# EAGLE schematic main (EAGLE 4.09)

## Sheet 1 of 8
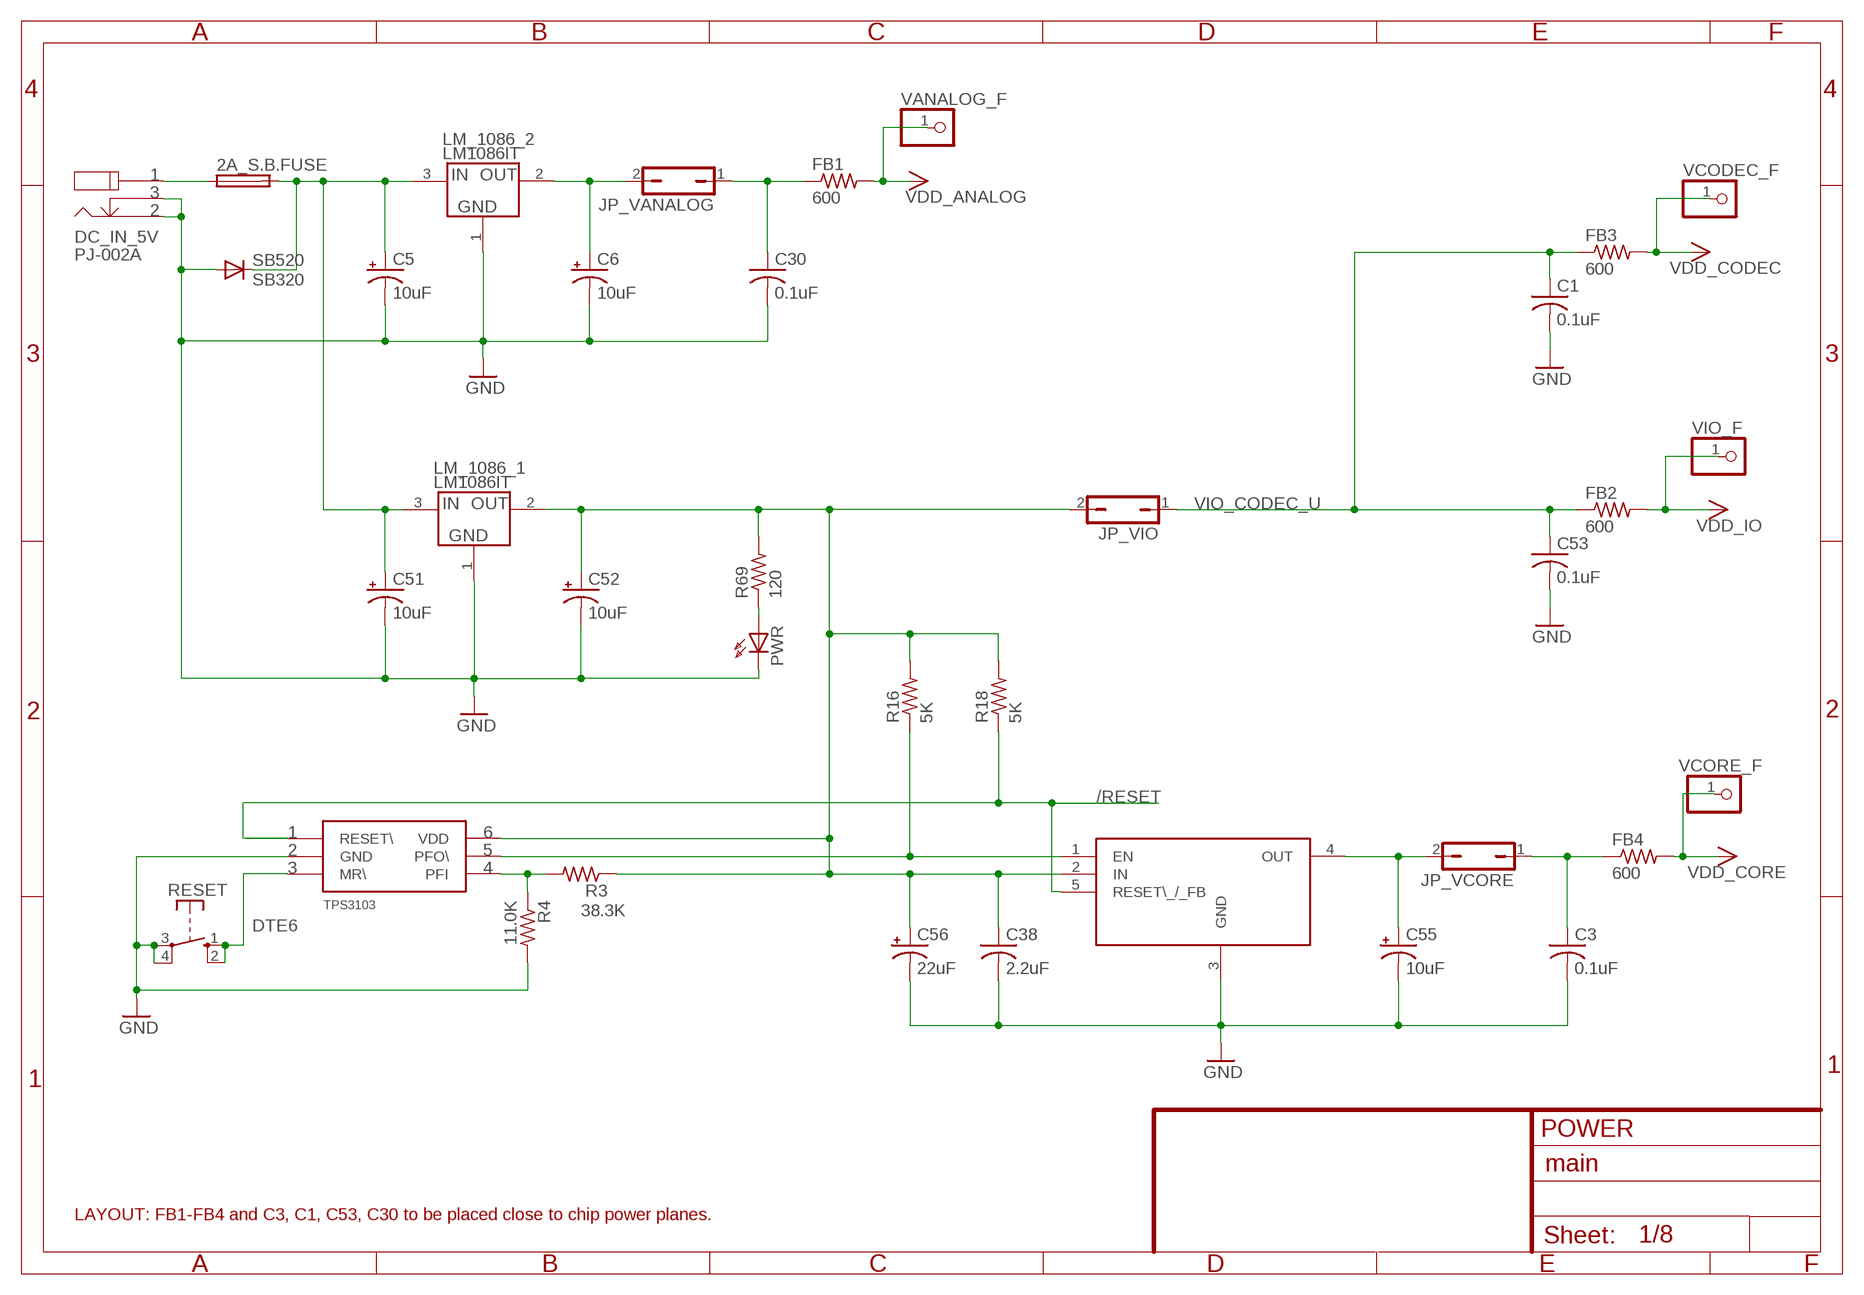
[diagram p0: schematic, sheet 1]

### Parts
2A_S.B.FUSE  LITTLEFUSE  [LITTLEFUSE]
C1  0.1uF  C-USC0603K  [C0603K]
C3  0.1uF  C-USC0603K  [C0603K]
C5  10uF  CPOL-USA/3216-18W  [A/3216-18W]
C6  10uF  CPOL-USA/3216-18W  [A/3216-18W]
C30  0.1uF  C-USC0603K  [C0603K]
C38  2.2uF  C-USC0603K  [C0603K]
C51  10uF  CPOL-USA/3216-18W  [A/3216-18W]
C52  10uF  CPOL-USA/3216-18W  [A/3216-18W]
C53  0.1uF  C-USC0603K  [C0603K]
C55  10uF  CPOL-USA/3216-18W  [A/3216-18W]
C56  22uF  CPOL-USA/3216-18W  [A/3216-18W]
DC_IN_5V  PJ-002A  [PJ-002A]
FB1  600  R-US_R1206  [R1206]
FB2  600  R-US_R1206  [R1206]
FB3  600  R-US_R1206  [R1206]
FB4  600  R-US_R1206  [R1206]
JP_VANALOG  JP1Q  [JP1]
JP_VCORE  JP1Q  [JP1]
JP_VIO  JP1Q  [JP1]
LM_1086_1  LM1086IT  [TO220_HSINK]
LM_1086_2  LM1086IT  [TO220_HSINK]
PWR  LEDSMT1206  [1206]
R3  38.3K  R-US_R0603  [R0603]
R4  11.0K  R-US_R0603  [R0603]
R16  5K  R-US_R0603  [R0603]
R18  5K  R-US_R0603  [R0603]
R69  120  R-US_R0603  [R0603]
RESET  DTE6  [DTE6]
SB520  SB320  [DO201-15]
TPS3103  TPS3103  [SO-06]
VANALOG_F  PINHD-1X1  [1X01]
VCODEC_F  PINHD-1X1  [1X01]
VCORE_F  PINHD-1X1  [1X01]
VIO_F  PINHD-1X1  [1X01]
VR_CORE  TPS72518DCQR  [SOT223-5]

### Nets
/RESET: R18.1 TPS3103.P$1(RESET\) VR_CORE.5(RESET\_/_FB) ; also sheet 5,6
GND: C1.2 C3.2 C5.- C6.- C30.2 C38.2 C51.- C52.- C53.2 C55.- C56.- DC_IN_5V.2 DC_IN_5V.3 LM_1086_1.1(ADJ) LM_1086_2.1(ADJ) PWR.C R4.2 RESET.3(P) RESET.4(P) SB520.A TPS3103.P$2(GND) VR_CORE.3(GND) ; also sheet 2,3,4,5,6,7,8
N$4: 2A_S.B.FUSE.1 DC_IN_5V.1
N$25: R3.2 R4.1 TPS3103.P$4(PFI)
N$29: RESET.1(S) RESET.2(S) TPS3103.P$3(MR\)
N$30: R16.1 TPS3103.P$5(PFO\) VR_CORE.1(EN)
N$31: C6.+ JP_VANALOG.2 LM_1086_2.2(OUT)
N$72: 2A_S.B.FUSE.2 C5.+ C51.+ LM_1086_1.3(IN) LM_1086_2.3(IN) SB520.C
N$94: C55.+ JP_VCORE.2 VR_CORE.4(OUT)
N$95: PWR.A R69.1
N$97: C38.1 C52.+ C56.+ JP_VIO.2 LM_1086_1.2(OUT) R3.1 R16.2 R18.2 R69.2 TPS3103.P$6(VDD) VR_CORE.2(IN)
VANALOG_U: C30.1 FB1.1 JP_VANALOG.1
VCORE_U: C3.1 FB4.1 JP_VCORE.1
VDD_ANALOG: FB1.2 VANALOG_F.1 ; also sheet 6,7,8
VDD_CODEC: FB3.2 VCODEC_F.1 ; also sheet 6
VDD_CORE: FB4.2 VCORE_F.1 ; also sheet 2,4,5
VDD_IO: FB2.2 VIO_F.1 ; also sheet 4,5
VIO_CODEC_U: C1.1 C53.1 FB2.1 FB3.1 JP_VIO.1 ; also sheet 2,3,4,5,6

### Notes on the sheet
- POWER
- LAYOUT: FB1-FB4 and C3, C1, C53, C30 to be placed close to chip power planes.

## Sheet 2 of 8
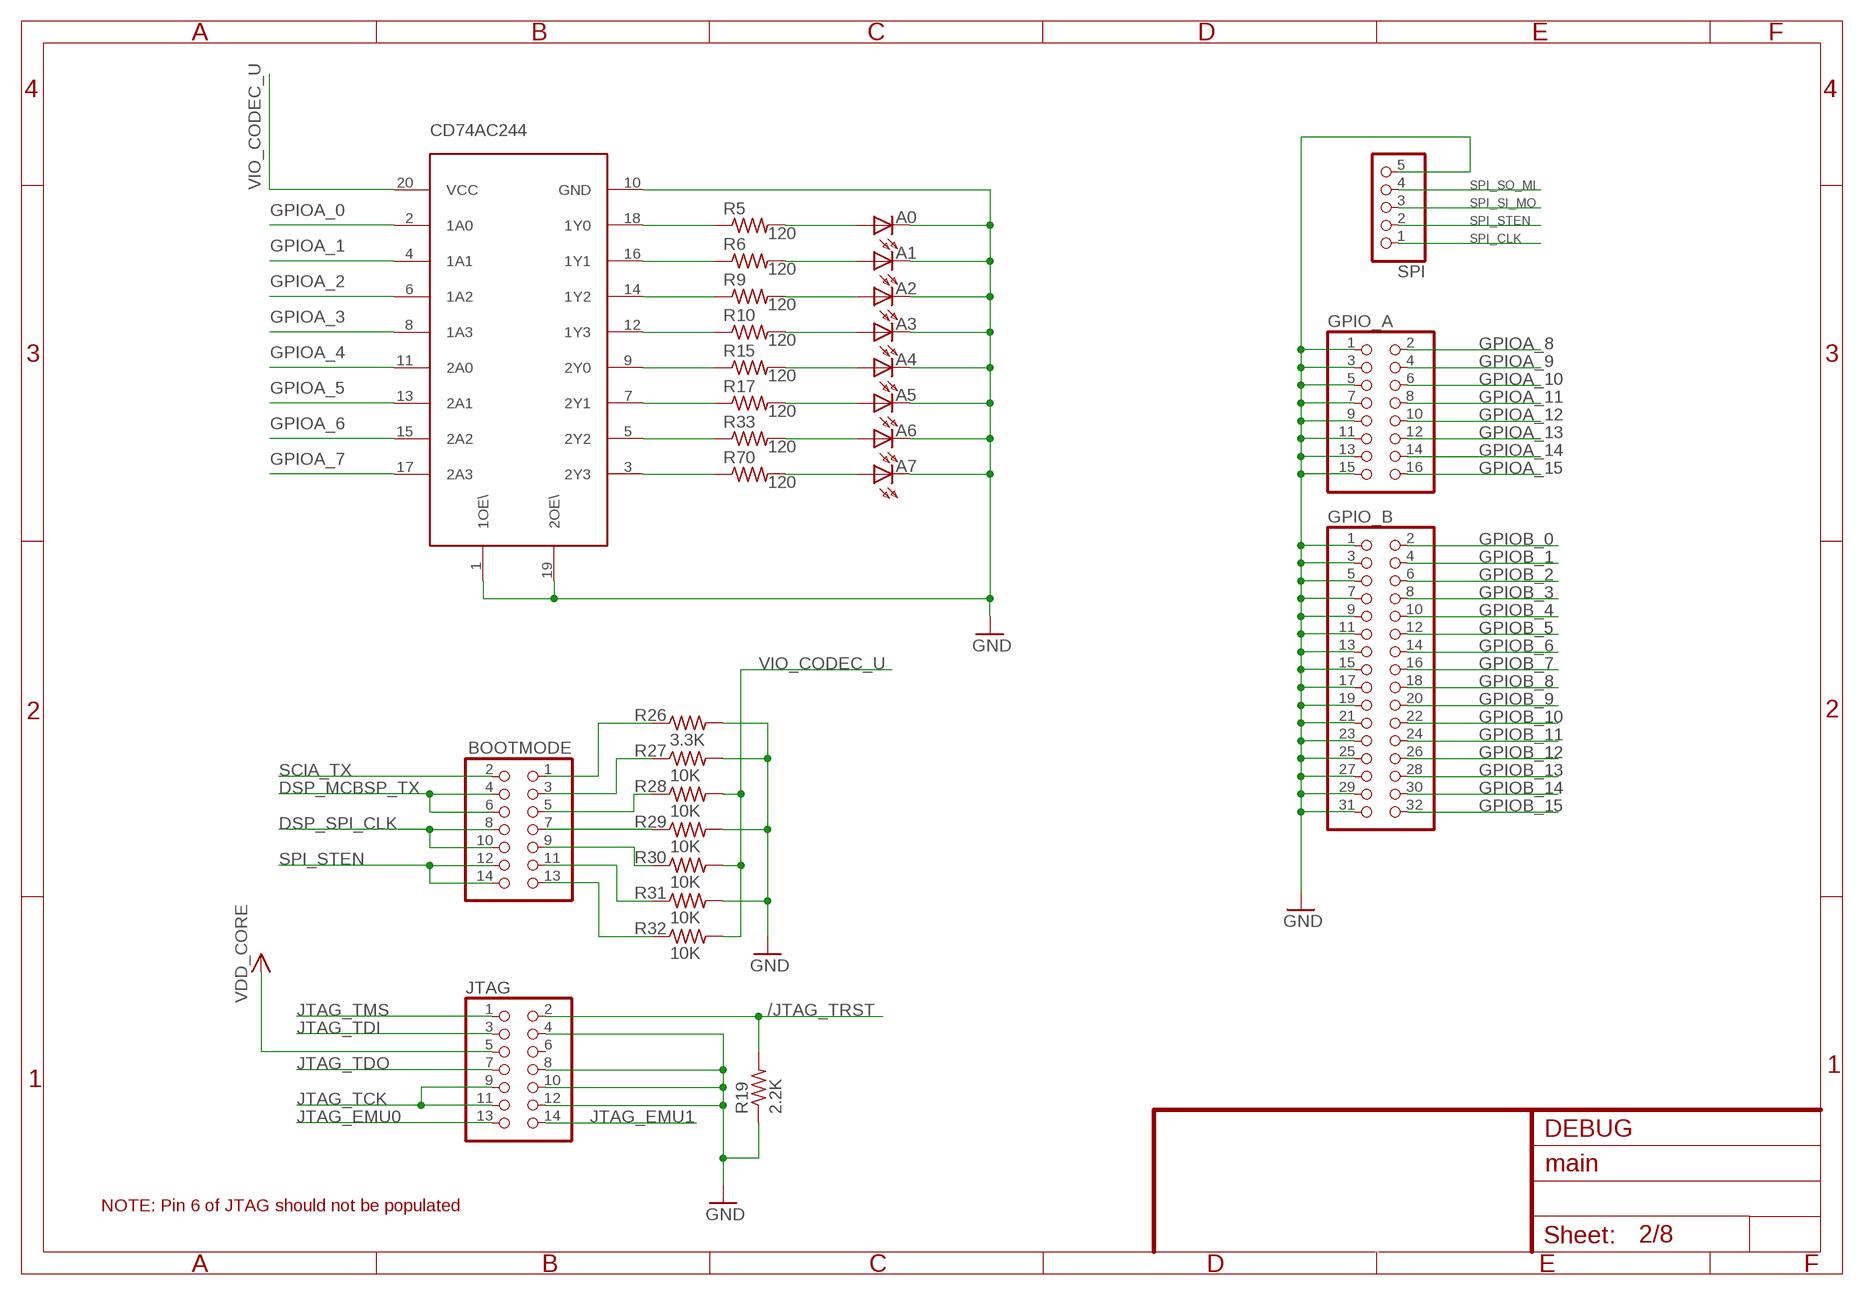
[diagram p1: schematic, sheet 2]

### Parts
A0  LEDSMT1206  [1206]
A1  LEDSMT1206  [1206]
A2  LEDSMT1206  [1206]
A3  LEDSMT1206  [1206]
A4  LEDSMT1206  [1206]
A5  LEDSMT1206  [1206]
A6  LEDSMT1206  [1206]
A7  LEDSMT1206  [1206]
BOOTMODE  PINHD-2X7  [2X07]
CD74AC244  CD74AC244  [SO-20DW]
GPIO_A  PINHD-2X8  [2X08]
GPIO_B  PINHD-2X16  [2X16]
JTAG  PINHD-2X7  [2X07]
R5  120  R-US_R0603  [R0603]
R6  120  R-US_R0603  [R0603]
R9  120  R-US_R0603  [R0603]
R10  120  R-US_R0603  [R0603]
R15  120  R-US_R0603  [R0603]
R17  120  R-US_R0603  [R0603]
R19  2.2K  R-US_R0603  [R0603]
R26  3.3K  R-US_R0603  [R0603]
R27  10K  R-US_R0603  [R0603]
R28  10K  R-US_R0603  [R0603]
R29  10K  R-US_R0603  [R0603]
R30  10K  R-US_R0603  [R0603]
R31  10K  R-US_R0603  [R0603]
R32  10K  R-US_R0603  [R0603]
R33  120  R-US_R0603  [R0603]
R70  120  R-US_R0603  [R0603]
SPI  PINHD-1X5  [1X05]

### Nets
/JTAG_TRST: JTAG.2 R19.2 ; also sheet 5
DSP_MCBSP_TX: BOOTMODE.4 BOOTMODE.6 ; also sheet 4
DSP_SPI_CLK: BOOTMODE.8 BOOTMODE.10 ; also sheet 4
GND: A0.C A1.C A2.C A3.C A4.C A5.C A6.C A7.C CD74AC244.1(1OE\) CD74AC244.10(GND) CD74AC244.19(2OE\) GPIO_A.1 GPIO_A.3 GPIO_A.5 GPIO_A.7 GPIO_A.9 GPIO_A.11 GPIO_A.13 GPIO_A.15 GPIO_B.1 GPIO_B.3 GPIO_B.5 GPIO_B.7 GPIO_B.9 GPIO_B.11 GPIO_B.13 GPIO_B.15 GPIO_B.17 GPIO_B.19 GPIO_B.21 GPIO_B.23 GPIO_B.25 GPIO_B.27 GPIO_B.29 GPIO_B.31 JTAG.4 JTAG.8 JTAG.10 JTAG.12 R19.1 R26.2 R27.2 R29.2 R31.2 SPI.5 ; also sheet 1,3,4,5,6,7,8
GPIOA_0: CD74AC244.2(1A0) ; also sheet 5
GPIOA_1: CD74AC244.4(1A1) ; also sheet 5
GPIOA_2: CD74AC244.6(1A2) ; also sheet 5
GPIOA_3: CD74AC244.8(1A3) ; also sheet 5
GPIOA_4: CD74AC244.11(2A0) ; also sheet 5
GPIOA_5: CD74AC244.13(2A1) ; also sheet 5
GPIOA_6: CD74AC244.15(2A2) ; also sheet 5
GPIOA_7: CD74AC244.17(2A3) ; also sheet 5
GPIOA_8: GPIO_A.2 ; also sheet 5
GPIOA_9: GPIO_A.4 ; also sheet 5
GPIOA_10: GPIO_A.6 ; also sheet 5
GPIOA_11: GPIO_A.8 ; also sheet 5
GPIOA_12: GPIO_A.10 ; also sheet 5
GPIOA_13: GPIO_A.12 ; also sheet 5
GPIOA_14: GPIO_A.14 ; also sheet 5
GPIOA_15: GPIO_A.16 ; also sheet 5
GPIOB_0: GPIO_B.2 ; also sheet 4
GPIOB_1: GPIO_B.4 ; also sheet 4
GPIOB_2: GPIO_B.6 ; also sheet 4
GPIOB_3: GPIO_B.8 ; also sheet 4
GPIOB_4: GPIO_B.10 ; also sheet 4
GPIOB_5: GPIO_B.12 ; also sheet 4
GPIOB_6: GPIO_B.14 ; also sheet 4
GPIOB_7: GPIO_B.16 ; also sheet 4
GPIOB_8: GPIO_B.18 ; also sheet 4
GPIOB_9: GPIO_B.20 ; also sheet 4
GPIOB_10: GPIO_B.22 ; also sheet 4
GPIOB_11: GPIO_B.24 ; also sheet 4
GPIOB_12: GPIO_B.26 ; also sheet 4
GPIOB_13: GPIO_B.28 ; also sheet 4
GPIOB_14: GPIO_B.30 ; also sheet 4
GPIOB_15: GPIO_B.32 ; also sheet 4
JTAG_EMU0: JTAG.13 ; also sheet 5
JTAG_EMU1: JTAG.14 ; also sheet 5
JTAG_TCK: JTAG.9 JTAG.11 ; also sheet 5
JTAG_TDI: JTAG.3 ; also sheet 5
JTAG_TDO: JTAG.7 ; also sheet 5
JTAG_TMS: JTAG.1 ; also sheet 5
N$1: CD74AC244.18(1Y0) R5.1
N$2: BOOTMODE.1 R26.1
N$6: BOOTMODE.3 R27.1
N$7: BOOTMODE.5 R28.1
N$9: BOOTMODE.7 R29.1
N$13: CD74AC244.16(1Y1) R6.1
N$16: BOOTMODE.9 R30.1
N$17: BOOTMODE.11 R31.1
N$21: BOOTMODE.13 R32.1
N$37: CD74AC244.14(1Y2) R9.1
N$46: CD74AC244.12(1Y3) R10.1
N$49: CD74AC244.9(2Y0) R15.1
N$57: CD74AC244.7(2Y1) R17.1
N$63: CD74AC244.5(2Y2) R33.1
N$69: CD74AC244.3(2Y3) R70.1
N$74: A0.A R5.2
N$87: A1.A R6.2
N$88: A2.A R9.2
N$89: A3.A R10.2
N$90: A4.A R15.2
N$91: A5.A R17.2
N$92: A6.A R33.2
N$93: A7.A R70.2
SCIA_TX: BOOTMODE.2 ; also sheet 3,5
SPI_CLK: SPI.1 ; also sheet 4
SPI_SI_MO: SPI.3 ; also sheet 4
SPI_SO_MI: SPI.4 ; also sheet 4
SPI_STEN: BOOTMODE.12 BOOTMODE.14 SPI.2 ; also sheet 4
VDD_CORE: JTAG.5 ; also sheet 1,4,5
VIO_CODEC_U: CD74AC244.20(VCC) R28.2 R30.2 R32.2 ; also sheet 1,3,4,5,6
Unconnected: JTAG.6

### Notes on the sheet
- DEBUG
- NOTE: Pin 6 of JTAG should not be populated

## Sheet 3 of 8
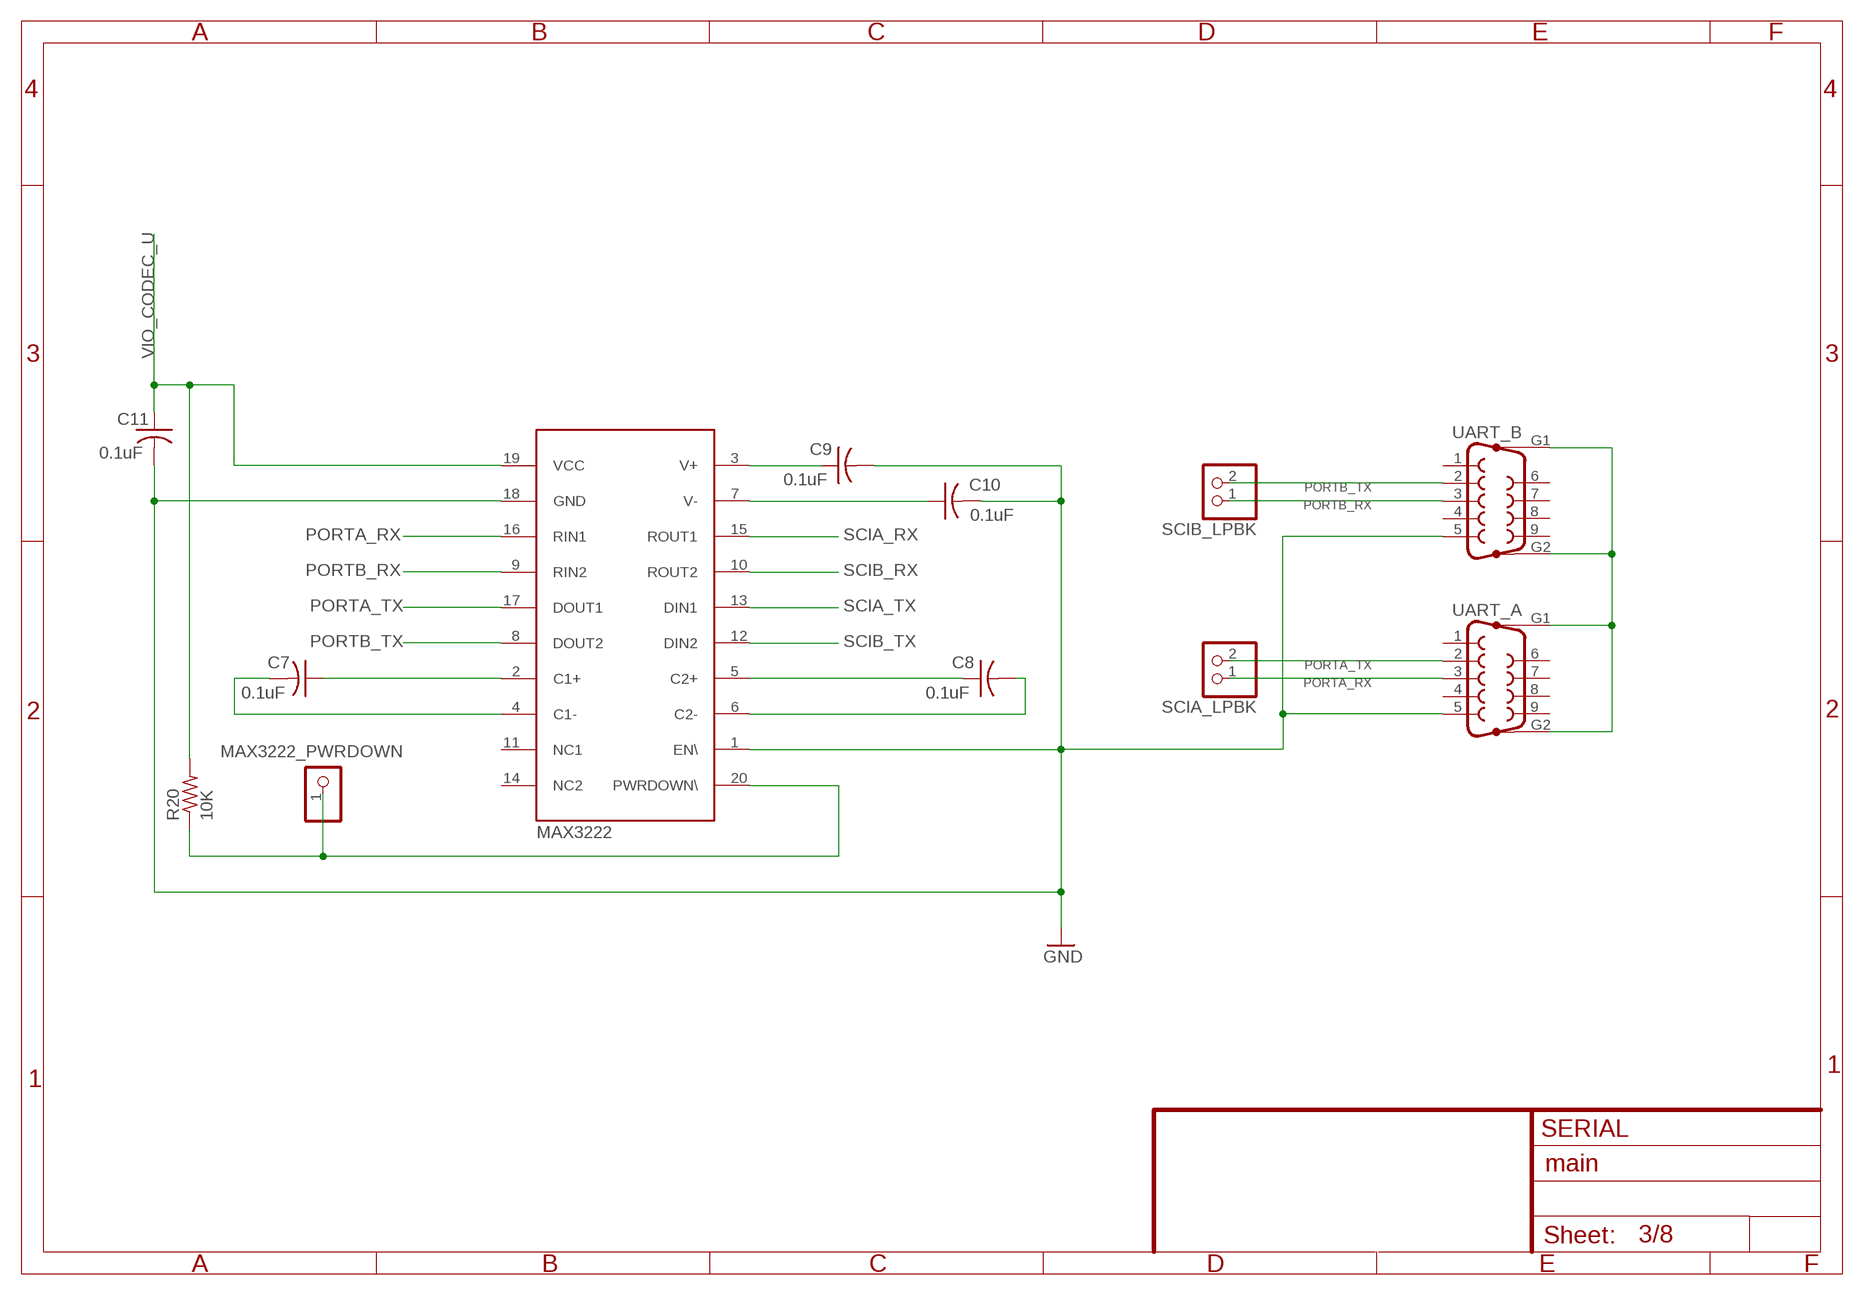
[diagram p2: schematic, sheet 3]

### Parts
C7  0.1uF  C-USC0603K  [C0603K]
C8  0.1uF  C-USC0603K  [C0603K]
C9  0.1uF  C-USC0603K  [C0603K]
C10  0.1uF  C-USC0603K  [C0603K]
C11  0.1uF  C-USC0603K  [C0603K]
MAX3222  MAX3222  [SO-20DW]
MAX3222_PWRDOWN  PINHD-1X1  [1X01]
R20  10K  R-US_R0603  [R0603]
SCIA_LPBK  PINHD-1X2  [1X02]
SCIB_LPBK  PINHD-1X2  [1X02]
UART_A  F09HP  [F09HP]
UART_B  F09HP  [F09HP]

### Nets
GND: C9.2 C10.2 C11.2 MAX3222.1(EN\) MAX3222.18(GND) UART_A.5 UART_B.5 ; also sheet 1,2,4,5,6,7,8
N$14: C7.1 MAX3222.2(C1+)
N$15: C7.2 MAX3222.4(C1-)
N$18: C8.2 MAX3222.6(C2-)
N$19: C8.1 MAX3222.5(C2+)
N$22: MAX3222.20(PWRDOWN\) MAX3222_PWRDOWN.1 R20.1
N$24: C10.1 MAX3222.7(V-)
N$26: C9.1 MAX3222.3(V+)
N$27: UART_A.G1 UART_A.G2 UART_B.G1 UART_B.G2
PORTA_RX: MAX3222.16(RIN1) SCIA_LPBK.1 UART_A.3
PORTA_TX: MAX3222.17(DOUT1) SCIA_LPBK.2 UART_A.2
PORTB_RX: MAX3222.9(RIN2) SCIB_LPBK.1 UART_B.3
PORTB_TX: MAX3222.8(DOUT2) SCIB_LPBK.2 UART_B.2
SCIA_RX: MAX3222.15(ROUT1) ; also sheet 5
SCIA_TX: MAX3222.13(DIN1) ; also sheet 2,5
SCIB_RX: MAX3222.10(ROUT2) ; also sheet 5
SCIB_TX: MAX3222.12(DIN2) ; also sheet 5
VIO_CODEC_U: C11.1 MAX3222.19(VCC) R20.2 ; also sheet 1,2,4,5,6
Unconnected: MAX3222.11(NC1) MAX3222.14(NC2) UART_A.1 UART_A.4 UART_A.6 UART_A.7 UART_A.8 UART_A.9 UART_B.1 UART_B.4 UART_B.6 UART_B.7 UART_B.8 UART_B.9

### Notes on the sheet
- SERIAL

## Sheet 4 of 8
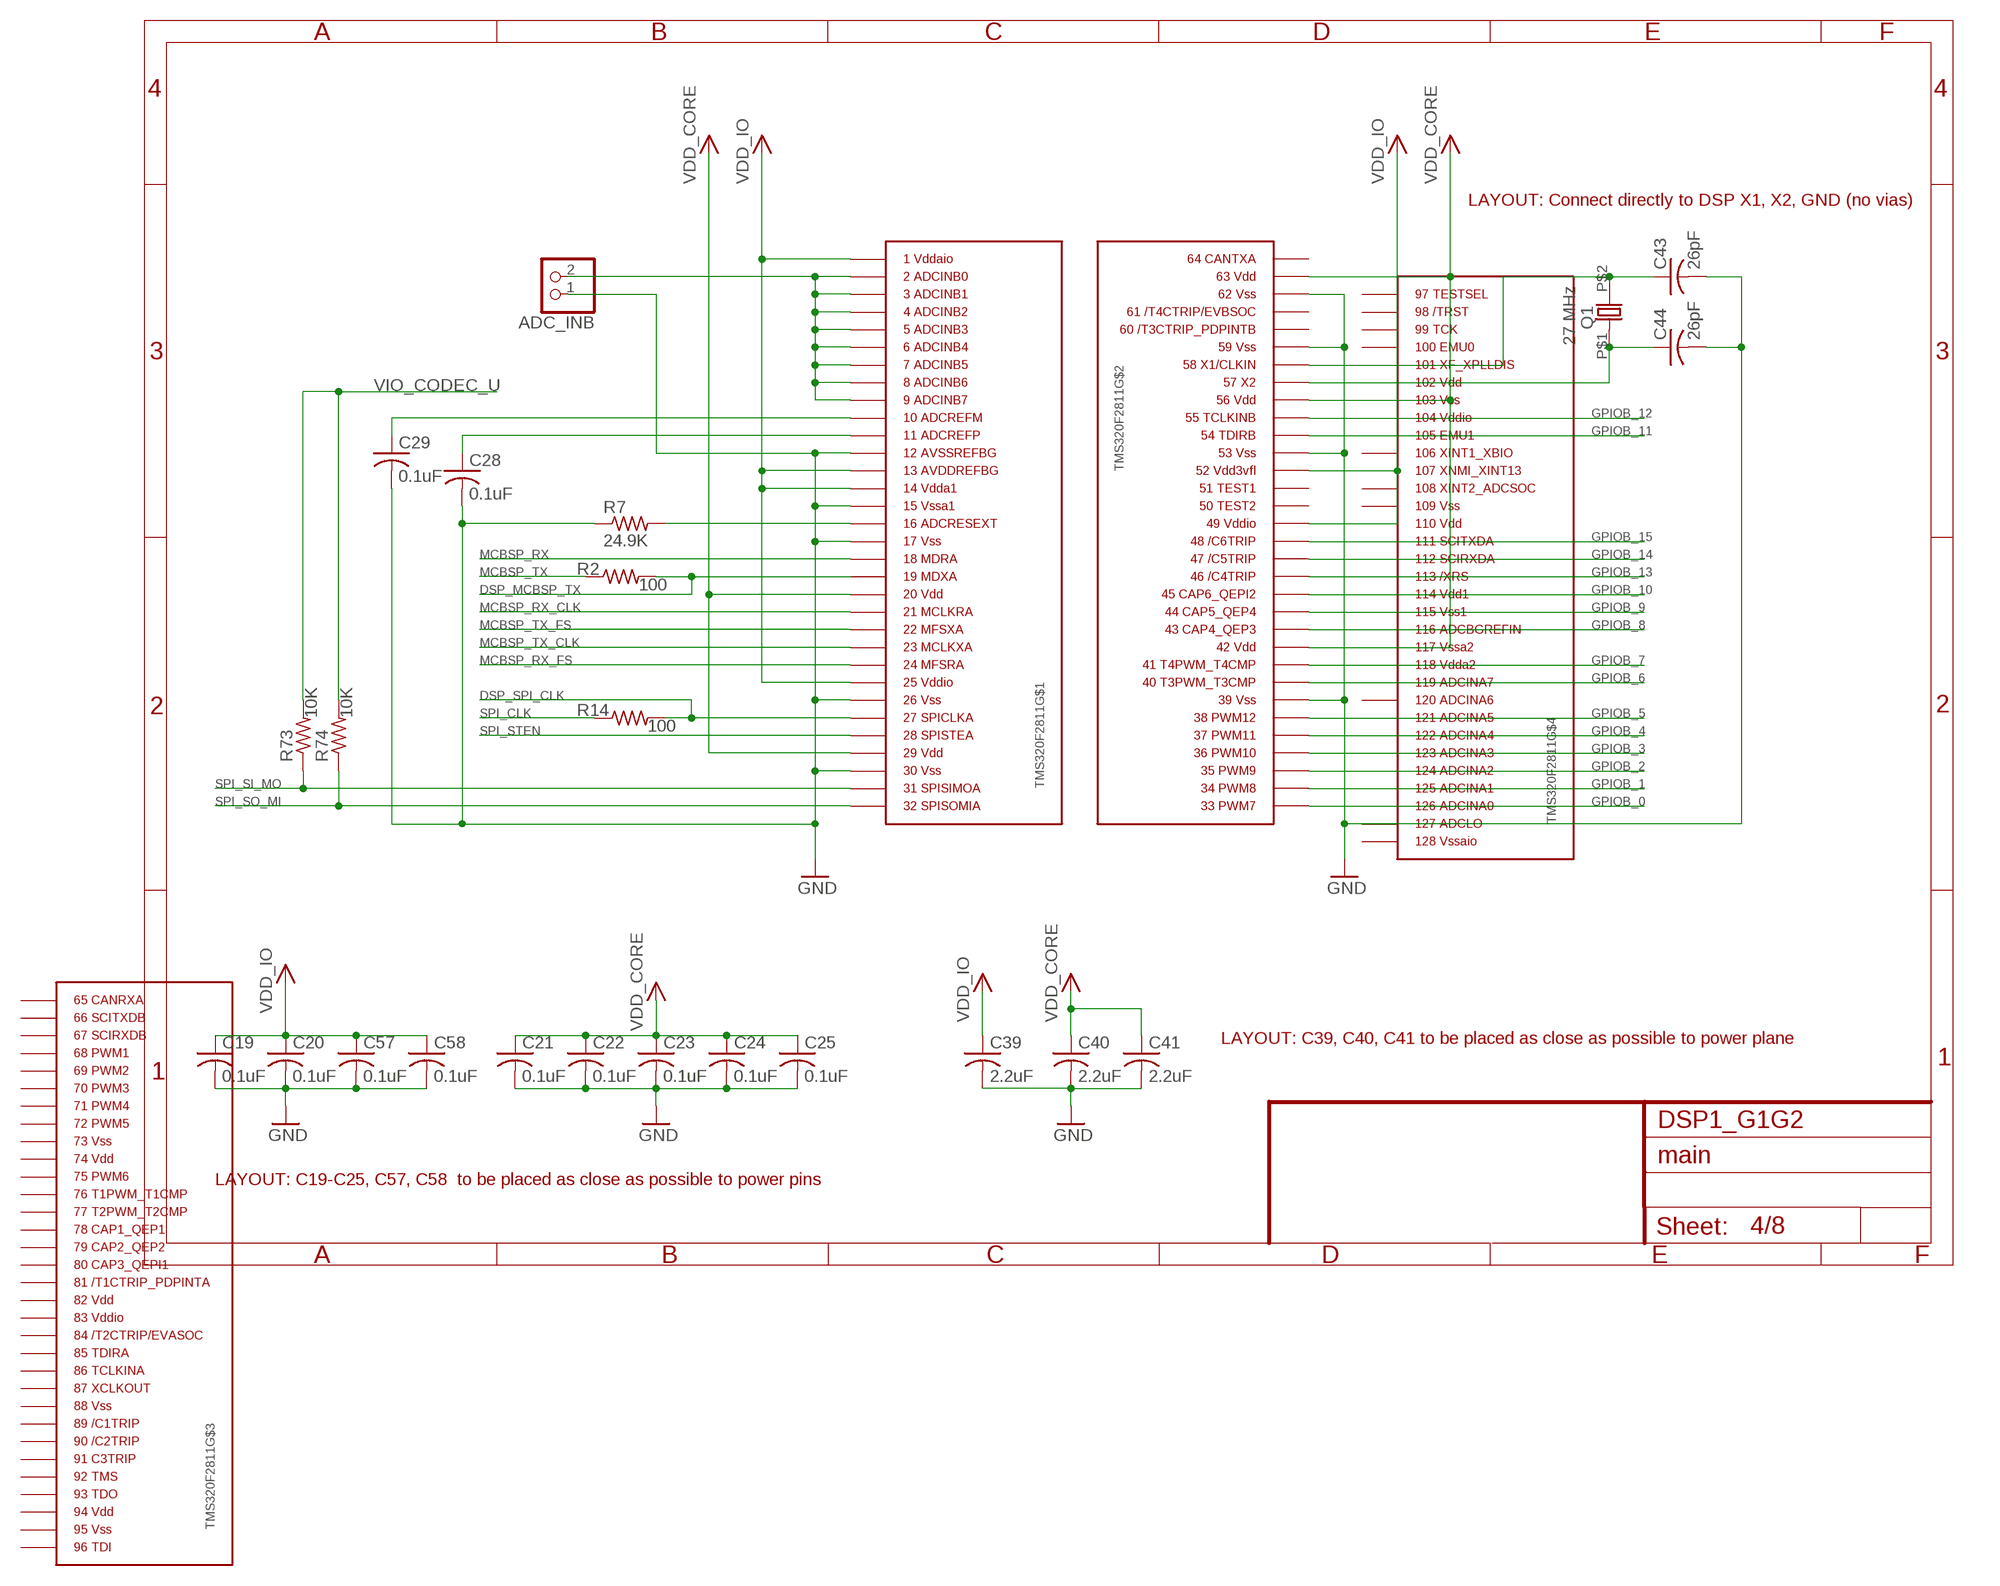
[diagram p3: schematic, sheet 4]

### Parts
ADC_INB  PINHD-1X2  [1X02]
C19  0.1uF  C-USC0603K  [C0603K]
C20  0.1uF  C-USC0603K  [C0603K]
C21  0.1uF  C-USC0603K  [C0603K]
C22  0.1uF  C-USC0603K  [C0603K]
C23  0.1uF  C-USC0603K  [C0603K]
C24  0.1uF  C-USC0603K  [C0603K]
C25  0.1uF  C-USC0603K  [C0603K]
C28  0.1uF  C-USC0603K  [C0603K]
C29  0.1uF  C-USC0603K  [C0603K]
C39  2.2uF  C-USC0805K  [C0805K]
C40  2.2uF  C-USC0805K  [C0805K]
C41  2.2uF  C-USC0805K  [C0805K]
C43  26pF  C-USC0603K  [C0603K]
C44  26pF  C-USC0603K  [C0603K]
C57  0.1uF  C-USC0603K  [C0603K]
C58  0.1uF  C-USC0603K  [C0603K]
Q1  27 MHz  CSA-309  [CSA-309]
R2  100  R-US_R0603  [R0603]
R7  24.9K  R-US_R0603  [R0603]
R14  100  R-US_R0603  [R0603]
R73  10K  R-US_R0603  [R0603]
R74  10K  R-US_R0603  [R0603]
TMS320F2811  TMS3202810  [PQFPG128]

### Nets
DSP_MCBSP_TX: R2.2 TMS320F2811.P$19 ; also sheet 2
DSP_SPI_CLK: R14.2 TMS320F2811.P$27 ; also sheet 2
GND: ADC_INB.1 C19.2 C20.2 C21.2 C22.2 C23.2 C24.2 C25.2 C28.2 C29.2 C39.2 C40.2 C41.2 C43.2 C44.2 C57.2 C58.2 R7.1 TMS320F2811.P$12 TMS320F2811.P$15 TMS320F2811.P$17 TMS320F2811.P$26 TMS320F2811.P$30 TMS320F2811.P$39 TMS320F2811.P$53 TMS320F2811.P$59 TMS320F2811.P$62 ; also sheet 1,2,3,5,6,7,8
GPIOB_0: TMS320F2811.P$33 ; also sheet 2
GPIOB_1: TMS320F2811.P$34 ; also sheet 2
GPIOB_2: TMS320F2811.P$35 ; also sheet 2
GPIOB_3: TMS320F2811.P$36 ; also sheet 2
GPIOB_4: TMS320F2811.P$37 ; also sheet 2
GPIOB_5: TMS320F2811.P$38 ; also sheet 2
GPIOB_6: TMS320F2811.P$40 ; also sheet 2
GPIOB_7: TMS320F2811.P$41 ; also sheet 2
GPIOB_8: TMS320F2811.P$43 ; also sheet 2
GPIOB_9: TMS320F2811.P$44 ; also sheet 2
GPIOB_10: TMS320F2811.P$45 ; also sheet 2
GPIOB_11: TMS320F2811.P$54 ; also sheet 2
GPIOB_12: TMS320F2811.P$55 ; also sheet 2
GPIOB_13: TMS320F2811.P$46 ; also sheet 2
GPIOB_14: TMS320F2811.P$47 ; also sheet 2
GPIOB_15: TMS320F2811.P$48 ; also sheet 2
MCBSP_RX: TMS320F2811.P$18 ; also sheet 6
MCBSP_RX_CLK: TMS320F2811.P$21 ; also sheet 6
MCBSP_RX_FS: TMS320F2811.P$24 ; also sheet 6
MCBSP_TX: R2.1 ; also sheet 6
MCBSP_TX_CLK: TMS320F2811.P$23 ; also sheet 6
MCBSP_TX_FS: TMS320F2811.P$22 ; also sheet 6
N$5: C29.1 TMS320F2811.P$10
N$8: C28.1 TMS320F2811.P$11
N$20: R7.2 TMS320F2811.P$16
N$47: C43.1 Q1.P$2 TMS320F2811.P$58
N$50: C44.1 Q1.P$1 TMS320F2811.P$57
N$96: ADC_INB.2 TMS320F2811.P$2 TMS320F2811.P$3 TMS320F2811.P$4 TMS320F2811.P$5 TMS320F2811.P$6 TMS320F2811.P$7 TMS320F2811.P$8 TMS320F2811.P$9
SPI_CLK: R14.1 ; also sheet 2
SPI_SI_MO: R73.1 TMS320F2811.P$31 ; also sheet 2
SPI_SO_MI: R74.1 TMS320F2811.P$32 ; also sheet 2
SPI_STEN: TMS320F2811.P$28 ; also sheet 2
VDD_CORE: C21.1 C22.1 C23.1 C24.1 C25.1 C40.1 C41.1 TMS320F2811.P$20 TMS320F2811.P$29 TMS320F2811.P$42 TMS320F2811.P$56 TMS320F2811.P$63 ; also sheet 1,2,5
VDD_IO: C19.1 C20.1 C39.1 C57.1 C58.1 TMS320F2811.P$1 TMS320F2811.P$13 TMS320F2811.P$14 TMS320F2811.P$25 TMS320F2811.P$49 TMS320F2811.P$52 ; also sheet 1,5
VIO_CODEC_U: R73.2 R74.2 ; also sheet 1,2,3,5,6
Unconnected: TMS320F2811.P$50 TMS320F2811.P$51 TMS320F2811.P$60 TMS320F2811.P$61 TMS320F2811.P$64

### Notes on the sheet
- LAYOUT: Connect directly to DSP X1, X2, GND (no vias)
- LAYOUT: C39, C40, C41 to be placed as close as possible to power plane
- DSP1_G1G2
- LAYOUT: C19-C25, C57, C58  to be placed as close as possible to power pins

## Sheet 5 of 8
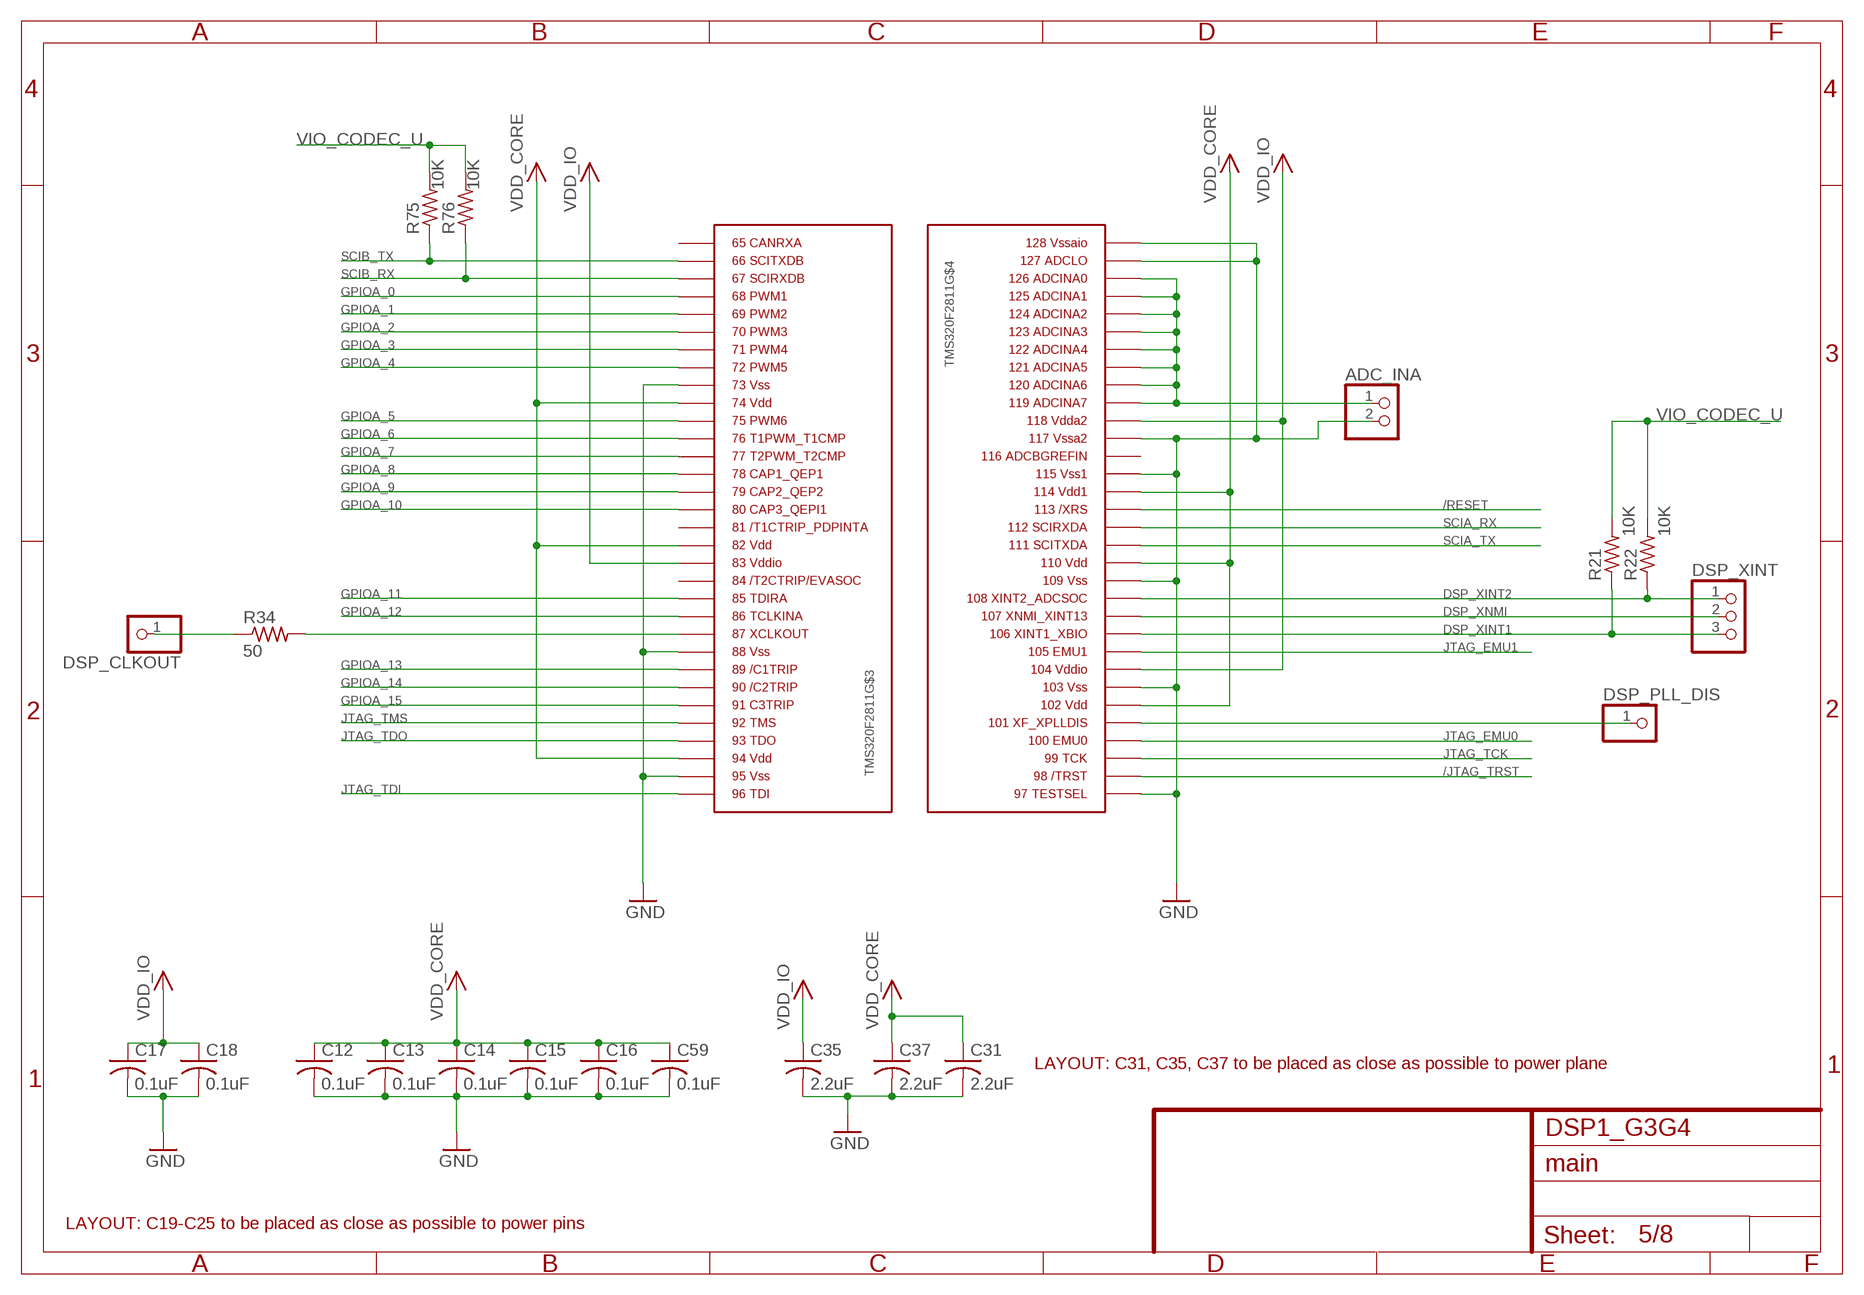
[diagram p4: schematic, sheet 5]

### Parts
ADC_INA  PINHD-1X2  [1X02]
C12  0.1uF  C-USC0603K  [C0603K]
C13  0.1uF  C-USC0603K  [C0603K]
C14  0.1uF  C-USC0603K  [C0603K]
C15  0.1uF  C-USC0603K  [C0603K]
C16  0.1uF  C-USC0603K  [C0603K]
C17  0.1uF  C-USC0603K  [C0603K]
C18  0.1uF  C-USC0603K  [C0603K]
C31  2.2uF  C-USC0805K  [C0805K]
C35  2.2uF  C-USC0805K  [C0805K]
C37  2.2uF  C-USC0805K  [C0805K]
C59  0.1uF  C-USC0603K  [C0603K]
DSP_CLKOUT  PINHD-1X1  [1X01]
DSP_PLL_DIS  PINHD-1X1  [1X01]
DSP_XINT  PINHD-1X3  [1X03]
R21  10K  R-US_R0603  [R0603]
R22  10K  R-US_R0603  [R0603]
R34  50  R-US_R0603  [R0603]
R75  10K  R-US_R0603  [R0603]
R76  10K  R-US_R0603  [R0603]

### Nets
/JTAG_TRST: TMS320F2811.P$98 ; also sheet 2
/RESET: TMS320F2811.P$113 ; also sheet 1,6
DSP_XINT1: DSP_XINT.3 R21.1 TMS320F2811.P$106
DSP_XINT2: DSP_XINT.1 R22.1 TMS320F2811.P$108
DSP_XNMI: DSP_XINT.2 TMS320F2811.P$107
GND: ADC_INA.2 C12.2 C13.2 C14.2 C15.2 C16.2 C17.2 C18.2 C31.2 C35.2 C37.2 C59.2 TMS320F2811.P$73 TMS320F2811.P$88 TMS320F2811.P$95 TMS320F2811.P$97 TMS320F2811.P$103 TMS320F2811.P$109 TMS320F2811.P$115 TMS320F2811.P$117 TMS320F2811.P$127 TMS320F2811.P$128 ; also sheet 1,2,3,4,6,7,8
GPIOA_0: TMS320F2811.P$68 ; also sheet 2
GPIOA_1: TMS320F2811.P$69 ; also sheet 2
GPIOA_2: TMS320F2811.P$70 ; also sheet 2
GPIOA_3: TMS320F2811.P$71 ; also sheet 2
GPIOA_4: TMS320F2811.P$72 ; also sheet 2
GPIOA_5: TMS320F2811.P$75 ; also sheet 2
GPIOA_6: TMS320F2811.P$76 ; also sheet 2
GPIOA_7: TMS320F2811.P$77 ; also sheet 2
GPIOA_8: TMS320F2811.P$78 ; also sheet 2
GPIOA_9: TMS320F2811.P$79 ; also sheet 2
GPIOA_10: TMS320F2811.P$80 ; also sheet 2
GPIOA_11: TMS320F2811.P$85 ; also sheet 2
GPIOA_12: TMS320F2811.P$86 ; also sheet 2
GPIOA_13: TMS320F2811.P$89 ; also sheet 2
GPIOA_14: TMS320F2811.P$90 ; also sheet 2
GPIOA_15: TMS320F2811.P$91 ; also sheet 2
JTAG_EMU0: TMS320F2811.P$100 ; also sheet 2
JTAG_EMU1: TMS320F2811.P$105 ; also sheet 2
JTAG_TCK: TMS320F2811.P$99 ; also sheet 2
JTAG_TDI: TMS320F2811.P$96 ; also sheet 2
JTAG_TDO: TMS320F2811.P$93 ; also sheet 2
JTAG_TMS: TMS320F2811.P$92 ; also sheet 2
N$12: DSP_PLL_DIS.1 TMS320F2811.P$101
N$48: DSP_CLKOUT.1 R34.1
N$51: R34.2 TMS320F2811.P$87
N$73: ADC_INA.1 TMS320F2811.P$119 TMS320F2811.P$120 TMS320F2811.P$121 TMS320F2811.P$122 TMS320F2811.P$123 TMS320F2811.P$124 TMS320F2811.P$125 TMS320F2811.P$126
SCIA_RX: TMS320F2811.P$112 ; also sheet 3
SCIA_TX: TMS320F2811.P$111 ; also sheet 2,3
SCIB_RX: R76.1 TMS320F2811.P$67 ; also sheet 3
SCIB_TX: R75.1 TMS320F2811.P$66 ; also sheet 3
VDD_CORE: C12.1 C13.1 C14.1 C15.1 C16.1 C31.1 C37.1 C59.1 TMS320F2811.P$74 TMS320F2811.P$82 TMS320F2811.P$94 TMS320F2811.P$102 TMS320F2811.P$110 TMS320F2811.P$114 ; also sheet 1,2,4
VDD_IO: C17.1 C18.1 C35.1 TMS320F2811.P$83 TMS320F2811.P$104 TMS320F2811.P$118 ; also sheet 1,4
VIO_CODEC_U: R21.2 R22.2 R75.2 R76.2 ; also sheet 1,2,3,4,6
Unconnected: TMS320F2811.P$65 TMS320F2811.P$81 TMS320F2811.P$84 TMS320F2811.P$116

### Notes on the sheet
- LAYOUT: C31, C35, C37 to be placed as close as possible to power plane
- DSP1_G3G4
- LAYOUT: C19-C25 to be placed as close as possible to power pins

## Sheet 6 of 8
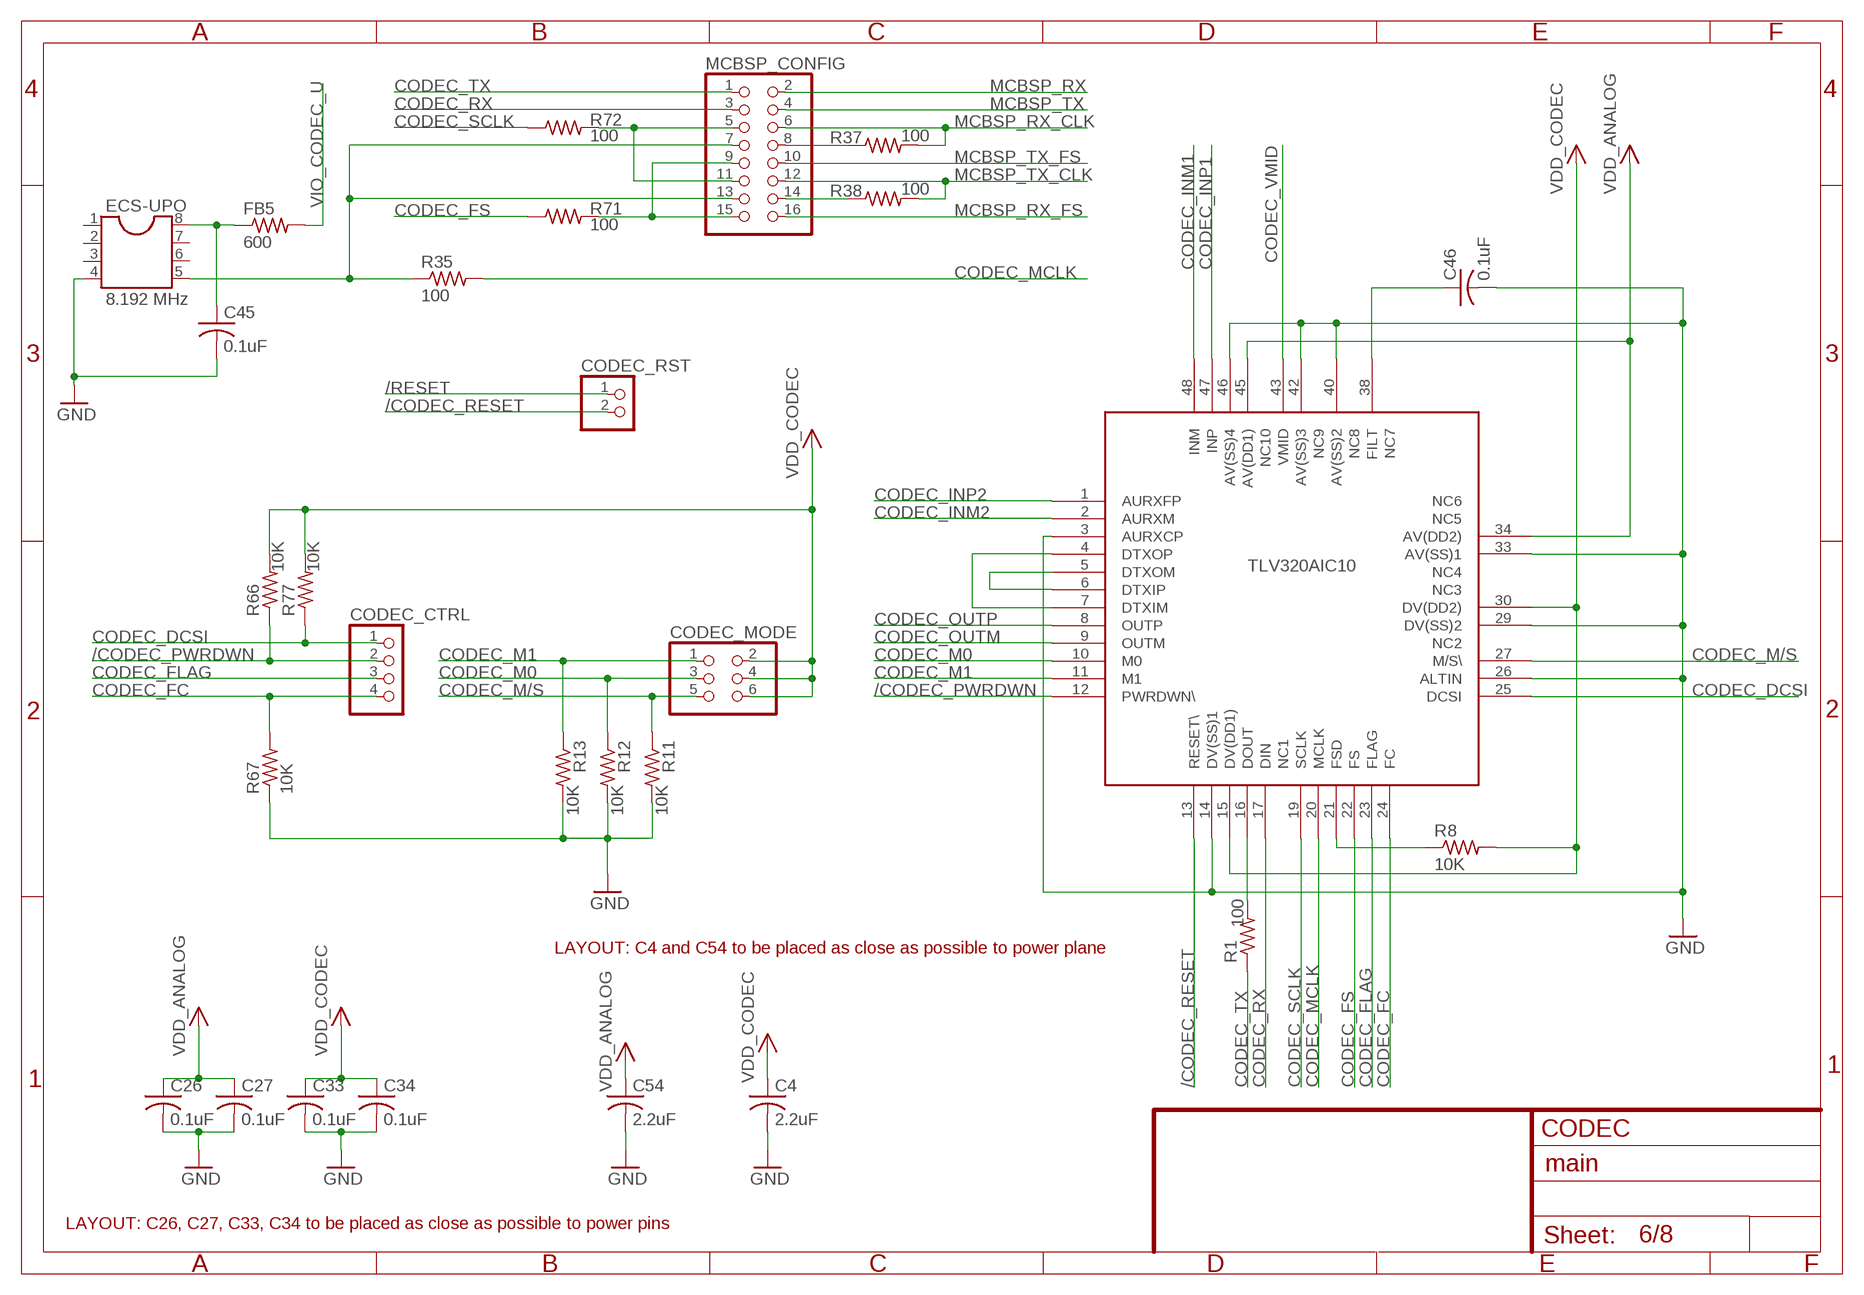
[diagram p5: schematic, sheet 6]

### Parts
C4  2.2uF  C-USC0805K  [C0805K]
C26  0.1uF  C-USC0603K  [C0603K]
C27  0.1uF  C-USC0603K  [C0603K]
C33  0.1uF  C-USC0603K  [C0603K]
C34  0.1uF  C-USC0603K  [C0603K]
C45  0.1uF  C-USC0603K  [C0603K]
C46  0.1uF  C-USC0603K  [C0603K]
C54  2.2uF  C-USC0805K  [C0805K]
CODEC_CTRL  PINHD-1X4  [1X04]
CODEC_MODE  PINHD-2X3  [2X03]
CODEC_RST  PINHD-1X2  [1X02]
ECS-UPO  8.192 MHz  DIL8  [DIL08]
FB5  600  R-US_R1206  [R1206]
MCBSP_CONFIG  PINHD-2X8  [2X08]
R1  100  R-US_R0603  [R0603]
R8  10K  R-US_R0603  [R0603]
R11  10K  R-US_R0603  [R0603]
R12  10K  R-US_R0603  [R0603]
R13  10K  R-US_R0603  [R0603]
R35  100  R-US_R0603  [R0603]
R37  100  R-US_R0603  [R0603]
R38  100  R-US_R0603  [R0603]
R66  10K  R-US_R0603  [R0603]
R67  10K  R-US_R0603  [R0603]
R71  100  R-US_R0603  [R0603]
R72  100  R-US_R0603  [R0603]
R77  10K  R-US_R0603  [R0603]
TLV320AIC10  TLV320AIC10  [PQFP48]

### Nets
/CODEC_PWRDWN: CODEC_CTRL.2 R66.1 TLV320AIC10.12(PWRDWN\)
/CODEC_RESET: CODEC_RST.2 TLV320AIC10.13(RESET\)
/RESET: CODEC_RST.1 ; also sheet 1,5
CODEC_DCSI: CODEC_CTRL.1 R77.1 TLV320AIC10.25(DCSI)
CODEC_FC: CODEC_CTRL.4 R67.2 TLV320AIC10.24(FC)
CODEC_FLAG: CODEC_CTRL.3 TLV320AIC10.23(FLAG)
CODEC_FS: R71.1 TLV320AIC10.22(FS)
CODEC_FSD: R8.1 TLV320AIC10.21(FSD)
CODEC_INM1: TLV320AIC10.48(INM) ; also sheet 7
CODEC_INM2: TLV320AIC10.2(AURXM) ; also sheet 7
CODEC_INP1: TLV320AIC10.47(INP) ; also sheet 7
CODEC_INP2: TLV320AIC10.1(AURXFP) ; also sheet 7
CODEC_M0: CODEC_MODE.3 R12.1 TLV320AIC10.10(M0)
CODEC_M1: CODEC_MODE.1 R13.1 TLV320AIC10.11(M1)
CODEC_M/S: CODEC_MODE.5 R11.1 TLV320AIC10.27(M/S\)
CODEC_MCLK: R35.2 TLV320AIC10.20(MCLK)
CODEC_OSC: ECS-UPO.5 MCBSP_CONFIG.7 MCBSP_CONFIG.13 R35.1
CODEC_OUTM: TLV320AIC10.9(OUTM) ; also sheet 8
CODEC_OUTP: TLV320AIC10.8(OUTP) ; also sheet 8
CODEC_RX: MCBSP_CONFIG.3 TLV320AIC10.17(DIN)
CODEC_SCLK: R72.1 TLV320AIC10.19(SCLK)
CODEC_TX: MCBSP_CONFIG.1 R1.1
CODEC_VMID: TLV320AIC10.43(VMID) ; also sheet 7
GND: C4.2 C26.2 C27.2 C33.2 C34.2 C45.2 C46.2 C54.2 ECS-UPO.4 R11.2 R12.2 R13.2 R67.1 TLV320AIC10.3(AURXCP) TLV320AIC10.14(DV(SS)1) TLV320AIC10.26(ALTIN) TLV320AIC10.29(DV(SS)2) TLV320AIC10.33(AV(SS)1) TLV320AIC10.40(AV(SS)2) TLV320AIC10.42(AV(SS)3) TLV320AIC10.46(AV(SS)4) ; also sheet 1,2,3,4,5,7,8
MCBSP_RX: MCBSP_CONFIG.2 ; also sheet 4
MCBSP_RX_CLK: MCBSP_CONFIG.6 R37.2 ; also sheet 4
MCBSP_RX_FS: MCBSP_CONFIG.16 ; also sheet 4
MCBSP_TX: MCBSP_CONFIG.4 ; also sheet 4
MCBSP_TX_CLK: MCBSP_CONFIG.12 R38.2 ; also sheet 4
MCBSP_TX_FS: MCBSP_CONFIG.10 ; also sheet 4
N$3: C45.1 ECS-UPO.8 FB5.1
N$23: MCBSP_CONFIG.5 MCBSP_CONFIG.11 R72.2
N$28: R1.2 TLV320AIC10.16(DOUT)
N$32: MCBSP_CONFIG.9 MCBSP_CONFIG.15 R71.2
N$33: MCBSP_CONFIG.8 R37.1
N$34: TLV320AIC10.4(DTXOP) TLV320AIC10.7(DTXIM)
N$35: MCBSP_CONFIG.14 R38.1
N$36: TLV320AIC10.5(DTXOM) TLV320AIC10.6(DTXIP)
N$59: C46.1 TLV320AIC10.38(FILT)
VDD_ANALOG: C26.1 C27.1 C54.1 TLV320AIC10.34(AV(DD2)) TLV320AIC10.45(AV(DD1)) ; also sheet 1,7,8
VDD_CODEC: C4.1 C33.1 C34.1 CODEC_MODE.2 CODEC_MODE.4 CODEC_MODE.6 R8.2 R66.2 R77.2 TLV320AIC10.15(DV(DD1)) TLV320AIC10.30(DV(DD2)) ; also sheet 1
VIO_CODEC_U: FB5.2 ; also sheet 1,2,3,4,5
Unconnected: ECS-UPO.1 ECS-UPO.2 ECS-UPO.3 ECS-UPO.6 ECS-UPO.7 TLV320AIC10.18(NC1) TLV320AIC10.28(NC2) TLV320AIC10.31(NC3) TLV320AIC10.32(NC4) TLV320AIC10.35(NC5) TLV320AIC10.36(NC6) TLV320AIC10.37(NC7) TLV320AIC10.39(NC8) TLV320AIC10.41(NC9) TLV320AIC10.44(NC10)

### Notes on the sheet
- LAYOUT: C4 and C54 to be placed as close as possible to power plane
- CODEC
- LAYOUT: C26, C27, C33, C34 to be placed as close as possible to power pins

## Sheet 7 of 8
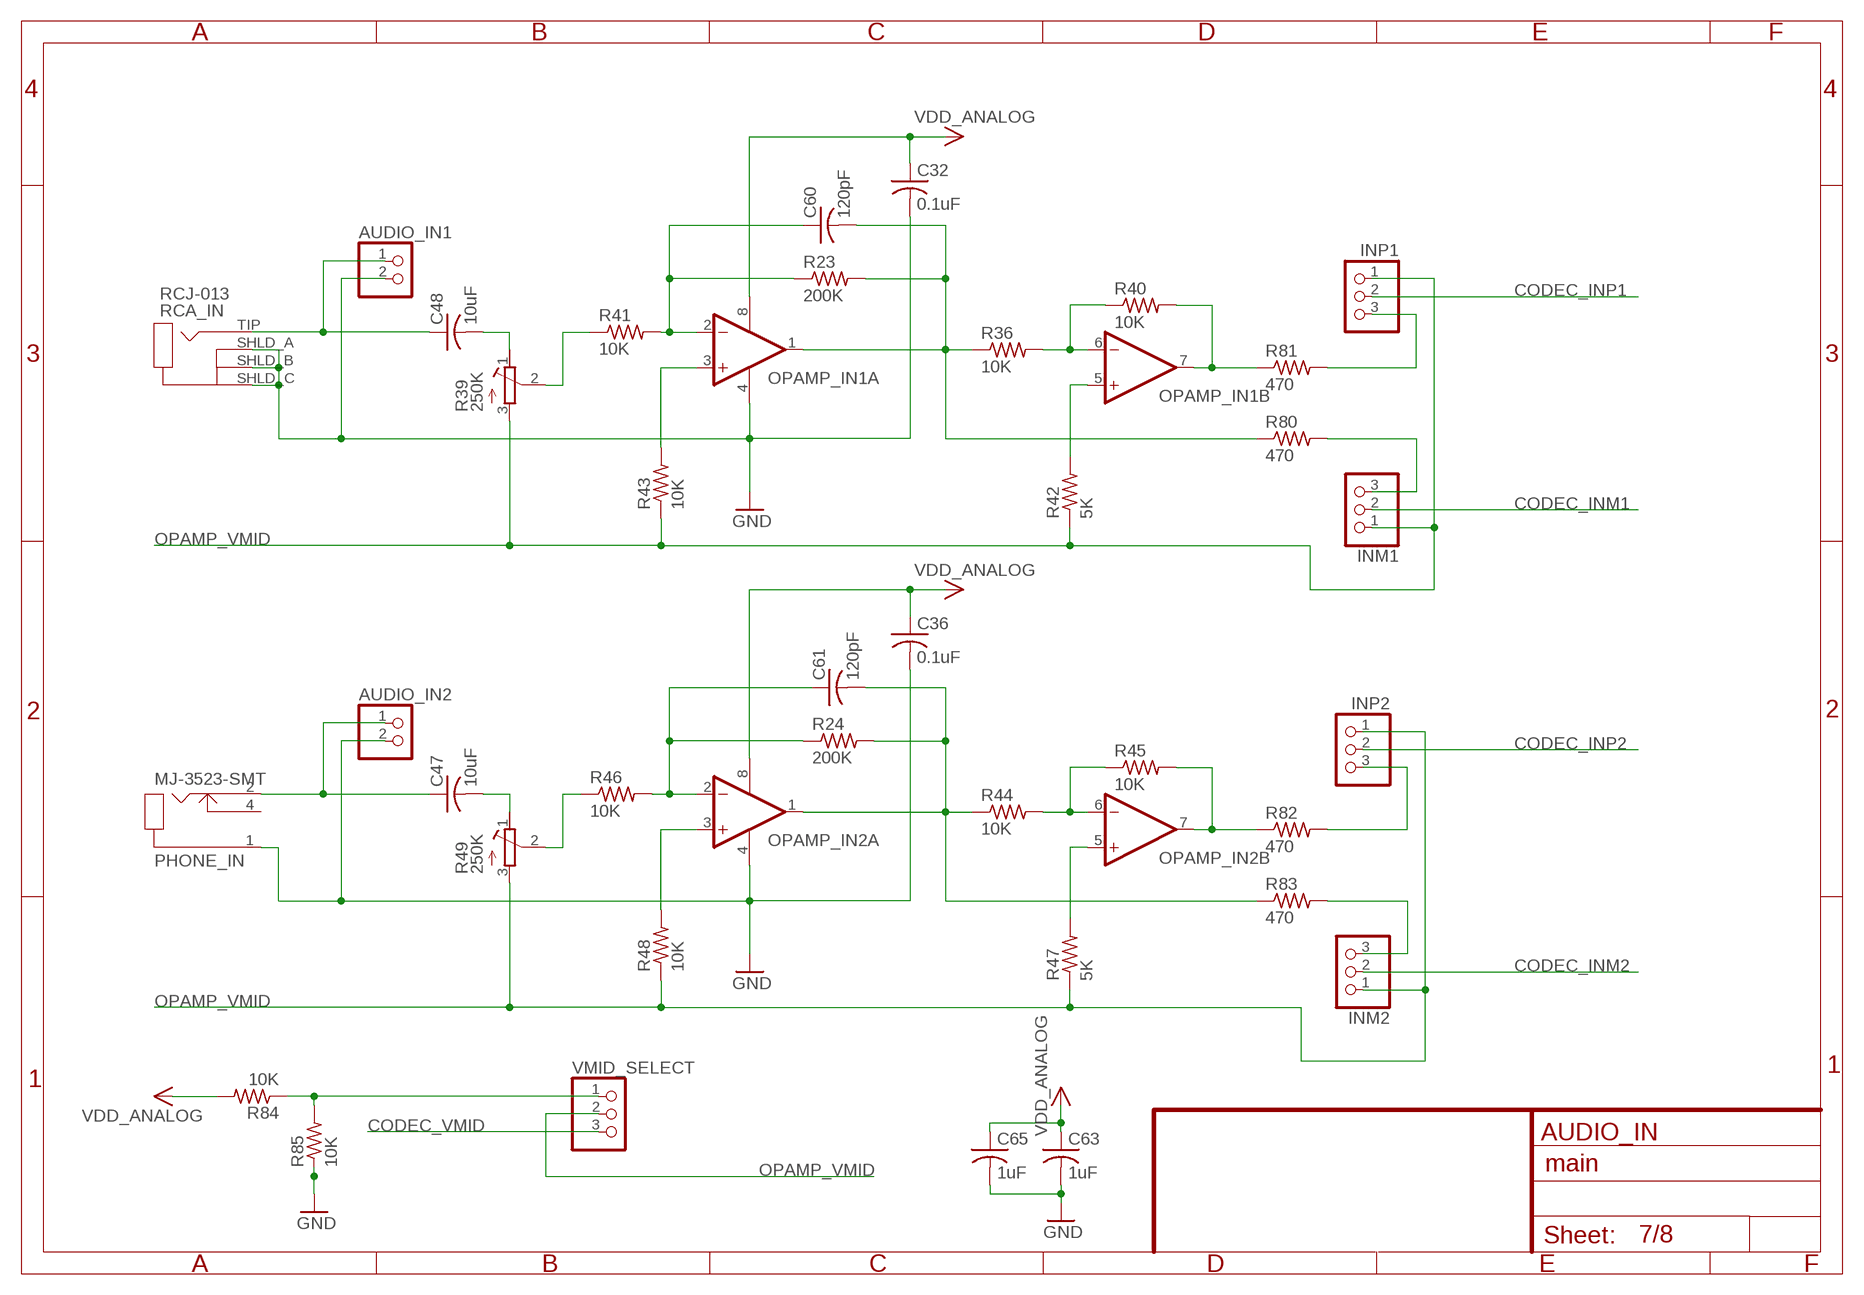
[diagram p6: schematic, sheet 7]

### Parts
AUDIO_IN1  PINHD-1X2  [1X02]
AUDIO_IN2  PINHD-1X2  [1X02]
C32  0.1uF  C-USC0603K  [C0603K]
C36  0.1uF  C-USC0603K  [C0603K]
C47  10uF  C-USC1206K  [C1206K]
C48  10uF  C-USC1206K  [C1206K]
C60  120pF  C-USC0805K  [C0805K]
C61  120pF  C-USC0805K  [C0805K]
C63  1uF  C-USC0805K  [C0805K]
C65  1uF  C-USC0805K  [C0805K]
INM1  PINHD-1X3  [1X03]
INM2  PINHD-1X3  [1X03]
INP1  PINHD-1X3  [1X03]
INP2  PINHD-1X3  [1X03]
OPAMP_IN1  2AMP_P8+4D  [SO08]
OPAMP_IN2  2AMP_P8+4D  [SO08]
PHONE_IN  MJ-3523-SMT  [MJ-3523-SMT]
R23  200K  R-US_R0805  [R0805]
R24  200K  R-US_R0805  [R0805]
R36  10K  R-US_R0805  [R0805]
R39  250K  R-TRIMMT93YB  [RTRIMT93YB]
R40  10K  R-US_R0805  [R0805]
R41  10K  R-US_R0805  [R0805]
R42  5K  R-US_R0805  [R0805]
R43  10K  R-US_R0805  [R0805]
R44  10K  R-US_R0805  [R0805]
R45  10K  R-US_R0805  [R0805]
R46  10K  R-US_R0805  [R0805]
R47  5K  R-US_R0805  [R0805]
R48  10K  R-US_R0805  [R0805]
R49  250K  R-TRIMMT93YB  [RTRIMT93YB]
R80  470  R-US_R0805  [R0805]
R81  470  R-US_R0805  [R0805]
R82  470  R-US_R0805  [R0805]
R83  470  R-US_R0805  [R0805]
R84  10K  R-US_R0805  [R0805]
R85  10K  R-US_R0805  [R0805]
RCA_IN  RCJ-013  [RCJ-013]
VMID_SELECT  PINHD-1X3  [1X03]

### Nets
CODEC_INM1: INM1.2 ; also sheet 6
CODEC_INM2: INM2.2 ; also sheet 6
CODEC_INP1: INP1.2 ; also sheet 6
CODEC_INP2: INP2.2 ; also sheet 6
CODEC_VMID: VMID_SELECT.3 ; also sheet 6
GND: AUDIO_IN1.2 AUDIO_IN2.2 C32.2 C36.2 C63.2 C65.2 OPAMP_IN1.4(P:V-) OPAMP_IN2.4(P:V-) PHONE_IN.1 R85.1 RCA_IN.SHLD_A RCA_IN.SHLD_B RCA_IN.SHLD_C ; also sheet 1,2,3,4,5,6,8
INM1: C60.2 OPAMP_IN1.1(A:OUT) R23.2 R36.1 R80.1
INM2: C61.2 OPAMP_IN2.1(A:OUT) R24.2 R44.1 R83.1
INP1: OPAMP_IN1.7(B:OUT) R40.2 R81.1
INP2: OPAMP_IN2.7(B:OUT) R45.2 R82.1
N$10: C48.2 R39.1(A)
N$11: AUDIO_IN2.1 C47.1 PHONE_IN.2
N$38: R39.2(S) R41.1
N$39: C47.2 R49.1(A)
N$41: R46.1 R49.2(S)
N$43: INP1.3 R81.2
N$44: INM1.3 R80.2
N$45: INM2.3 R83.2
N$52: OPAMP_IN1.6(B:-IN) R36.2 R40.1
N$54: INP2.3 R82.2
N$55: OPAMP_IN1.5(B:+IN) R42.2
N$60: AUDIO_IN1.1 C48.1 RCA_IN.TIP
N$61: OPAMP_IN1.3(A:+IN) R43.2
N$62: C60.1 OPAMP_IN1.2(A:-IN) R23.1 R41.2
N$67: OPAMP_IN2.6(B:-IN) R44.2 R45.1
N$68: OPAMP_IN2.5(B:+IN) R47.2
N$70: OPAMP_IN2.3(A:+IN) R48.2
N$71: C61.1 OPAMP_IN2.2(A:-IN) R24.1 R46.2
N$86: R84.1 R85.2 VMID_SELECT.1
OPAMP_VMID: INM1.1 INM2.1 INP1.1 INP2.1 R39.3(E) R42.1 R43.1 R47.1 R48.1 R49.3(E) VMID_SELECT.2 ; also sheet 8
VDD_ANALOG: C32.1 C36.1 C63.1 C65.1 OPAMP_IN1.8(P:V+) OPAMP_IN2.8(P:V+) R84.2 ; also sheet 1,6,8
Unconnected: PHONE_IN.4

### Notes on the sheet
- AUDIO_IN

## Sheet 8 of 8
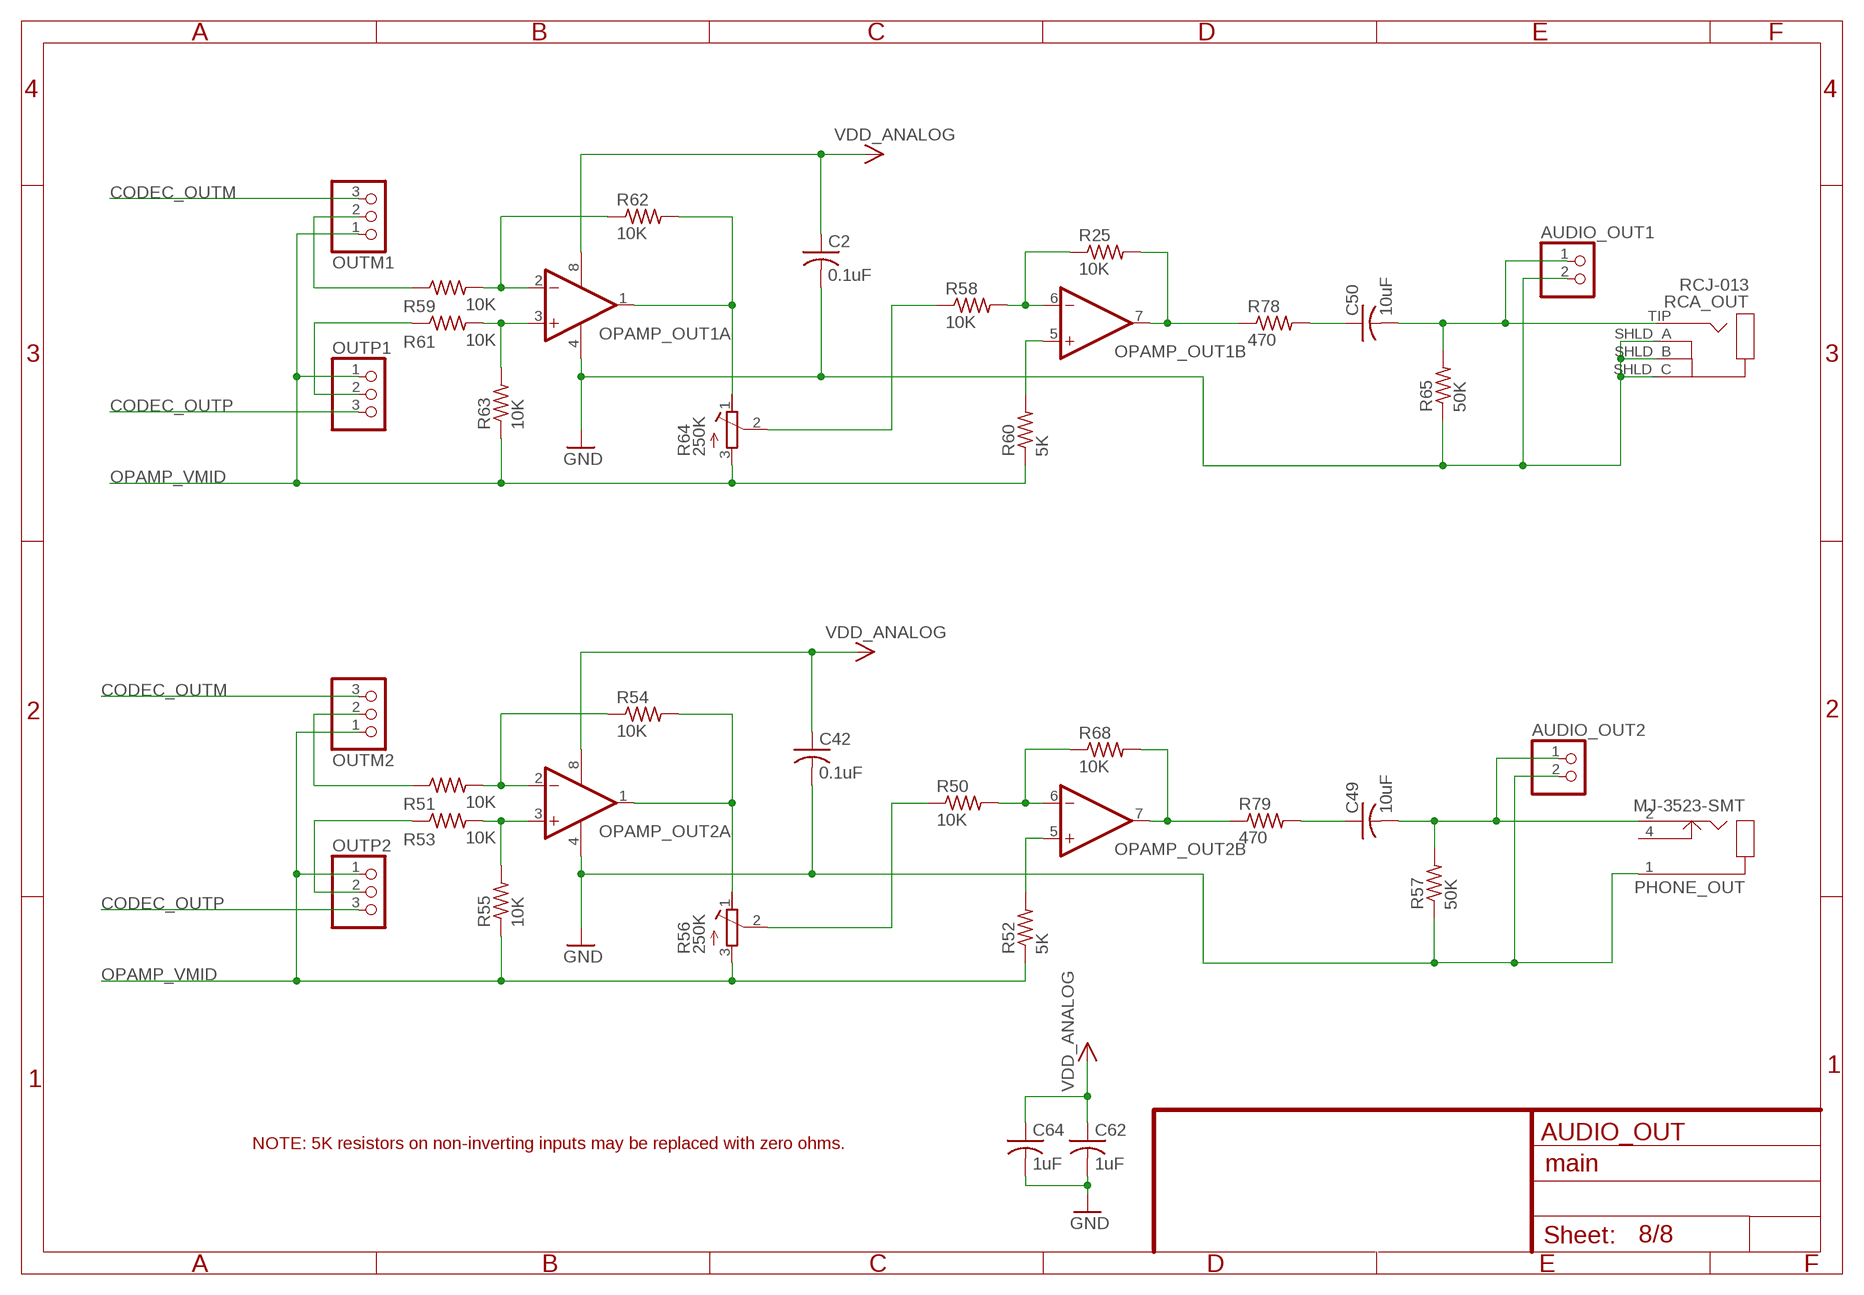
[diagram p7: schematic, sheet 8]

### Parts
AUDIO_OUT1  PINHD-1X2  [1X02]
AUDIO_OUT2  PINHD-1X2  [1X02]
C2  0.1uF  C-USC0603K  [C0603K]
C42  0.1uF  C-USC0603K  [C0603K]
C49  10uF  C-USC1206K  [C1206K]
C50  10uF  C-USC1206K  [C1206K]
C62  1uF  C-USC0805K  [C0805K]
C64  1uF  C-USC0805K  [C0805K]
OPAMP_OUT1  2AMP_P8+4D  [SO08]
OPAMP_OUT2  2AMP_P8+4D  [SO08]
OUTM1  PINHD-1X3  [1X03]
OUTM2  PINHD-1X3  [1X03]
OUTP1  PINHD-1X3  [1X03]
OUTP2  PINHD-1X3  [1X03]
PHONE_OUT  MJ-3523-SMT  [MJ-3523-SMT]
R25  10K  R-US_R0805  [R0805]
R50  10K  R-US_R0805  [R0805]
R51  10K  R-US_R0805  [R0805]
R52  5K  R-US_R0805  [R0805]
R53  10K  R-US_R0805  [R0805]
R54  10K  R-US_R0805  [R0805]
R55  10K  R-US_R0805  [R0805]
R56  250K  R-TRIMMT93YB  [RTRIMT93YB]
R57  50K  R-US_R0805  [R0805]
R58  10K  R-US_R0805  [R0805]
R59  10K  R-US_R0805  [R0805]
R60  5K  R-US_R0805  [R0805]
R61  10K  R-US_R0805  [R0805]
R62  10K  R-US_R0805  [R0805]
R63  10K  R-US_R0805  [R0805]
R64  250K  R-TRIMMT93YB  [RTRIMT93YB]
R65  50K  R-US_R0805  [R0805]
R68  10K  R-US_R0805  [R0805]
R78  470  R-US_R0805  [R0805]
R79  470  R-US_R0805  [R0805]
RCA_OUT  RCJ-013  [RCJ-013]

### Nets
CODEC_OUTM: OUTM1.3 OUTM2.3 ; also sheet 6
CODEC_OUTP: OUTP1.3 OUTP2.3 ; also sheet 6
GND: AUDIO_OUT1.2 AUDIO_OUT2.2 C2.2 C42.2 C62.2 C64.2 OPAMP_OUT1.4(P:V-) OPAMP_OUT2.4(P:V-) PHONE_OUT.1 R57.1 R65.1 RCA_OUT.SHLD_A RCA_OUT.SHLD_B RCA_OUT.SHLD_C ; also sheet 1,2,3,4,5,6,7
N$40: C50.1 R78.2
N$42: R58.1 R64.2(S)
N$53: C49.1 R79.2
N$56: R50.1 R56.2(S)
N$64: OPAMP_OUT2.6(B:-IN) R50.2 R68.1
N$65: OPAMP_OUT2.5(B:+IN) R52.2
N$66: OPAMP_OUT2.7(B:OUT) R68.2 R79.1
N$75: OPAMP_OUT2.2(A:-IN) R51.2 R54.1
N$76: OPAMP_OUT2.3(A:+IN) R53.2 R55.2
N$77: OPAMP_OUT2.1(A:OUT) R54.2 R56.1(A)
N$78: OPAMP_OUT1.6(B:-IN) R25.1 R58.2
N$79: OPAMP_OUT1.5(B:+IN) R60.2
N$80: OPAMP_OUT1.7(B:OUT) R25.2 R78.1
N$81: AUDIO_OUT2.1 C49.2 PHONE_OUT.2 R57.2
N$82: OPAMP_OUT1.2(A:-IN) R59.2 R62.1
N$83: OPAMP_OUT1.3(A:+IN) R61.2 R63.2
N$84: OPAMP_OUT1.1(A:OUT) R62.2 R64.1(A)
N$85: AUDIO_OUT1.1 C50.2 R65.2 RCA_OUT.TIP
OPAMP_VMID: OUTM1.1 OUTM2.1 OUTP1.1 OUTP2.1 R52.1 R55.1 R56.3(E) R60.1 R63.1 R64.3(E) ; also sheet 7
OUTM1: OUTM1.2 R59.1
OUTM2: OUTM2.2 R51.1
OUTP1: OUTP1.2 R61.1
OUTP2: OUTP2.2 R53.1
VDD_ANALOG: C2.1 C42.1 C62.1 C64.1 OPAMP_OUT1.8(P:V+) OPAMP_OUT2.8(P:V+) ; also sheet 1,6,7
Unconnected: PHONE_OUT.4

### Notes on the sheet
- AUDIO_OUT
- NOTE: 5K resistors on non-inverting inputs may be replaced with zero ohms.

## Library data of the parts
2A_S.B.FUSE = fuse:LITTLEFUSE: LITTLEFUSE Picofuse/slow Littlefuse
A0 A1-A7 PWR = led:LED: LED
ADC_INA ADC_INB AUDIO_IN1 AUDIO_IN2 AUDIO_OUT1 AUDIO_OUT2 CODEC_RST SCIA_LPBK SCIB_LPBK = pinhead:PINHD-1X2: PIN HEADER
BOOTMODE JTAG = pinhead:PINHD-2X7: PIN HEADER
C1-C4 C7-C50 C53 C54 C57-C65 = rcl:C-US: CAPACITOR, American symbol
C5 C6 C51 C52 C55 C56 = rcl:CPOL-US: POLARIZED CAPACITOR, American symbol
CD74AC244 = CD74AC244:CD74AC244
CODEC_CTRL = pinhead:PINHD-1X4: PIN HEADER
CODEC_MODE = pinhead:PINHD-2X3: PIN HEADER
DC_IN_5V = PJ-002A-SMT-1:PJ-002A
DSP_CLKOUT DSP_PLL_DIS MAX3222_PWRDOWN VANALOG_F VCODEC_F VCORE_F VIO_F = pinhead:PINHD-1X1: PIN HEADER
DSP_XINT INM1 INM2 INP1 INP2 OUTM1 OUTM2 OUTP1 OUTP2 VMID_SELECT = pinhead:PINHD-1X3: PIN HEADER
ECS-UPO = dil:DIL8: SOCKET Dual In Line
FB1-FB5 R1-R38 R40-R48 R50-R55 R57-R63 R65-R85 = rcl:R-US_: RESISTOR, American symbol
GPIO_A MCBSP_CONFIG = pinhead:PINHD-2X8: PIN HEADER
GPIO_B = pinhead:PINHD-2X16: PIN HEADER
JP_VANALOG JP_VCORE JP_VIO = jumper:JP1Q: JUMPER
LM_1086_1 LM_1086_2 = LM1086IT-3.3:LM1086IT
MAX3222 = MAX3222:MAX3222: 3V to 5.5V Multichannel RS-232 Line Driver/Receiver
OPAMP_IN1 OPAMP_IN2 OPAMP_OUT1 OPAMP_OUT2 = linear:2AMP_P8+4: OP AMP
PHONE_IN PHONE_OUT = MJ-3523-SMT:MJ-3523-SMT
Q1 = CSA-309:CSA-309
R39 R49 R56 R64 = rcl:R-TRIMM: Trimm resistor
RCA_IN RCA_OUT = RCJ-013:RCJ-013
RESET = switch-misc:DT: ITT SWITCH
SB520 = diode:SB320: DIODE barrier rectifier, 3 A (Fairchild)
SPI = pinhead:PINHD-1X5: PIN HEADER
TLV320AIC10 = TLV320AIC10:TLV320AIC10: Audio Codec
TMS320F2811 = TMS2810:TMS3202810
TPS3103 = TPS310x:TPS3103
UART_A UART_B = con-subd:F09HP: SUB-D
VR_CORE = TPS72518DCQR:TPS72518DCQR